# EAGLE design encoder-hbridge (EAGLE 6.4)
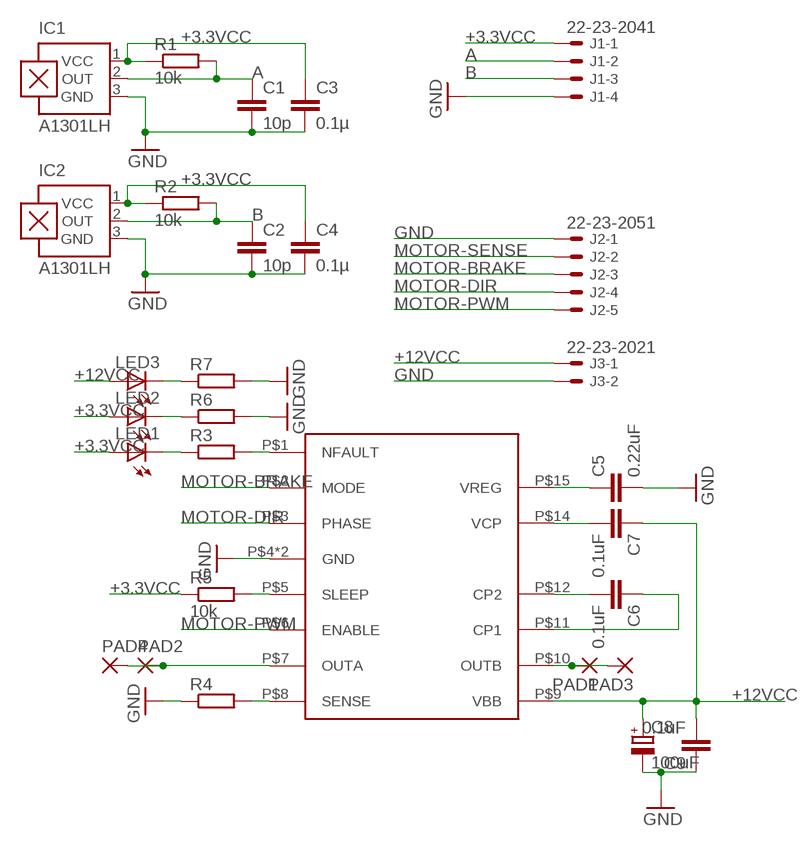
[diagram p0: schematic, sheet 1]

## Parts
C1  10p  C-EUC0805  [C0805]
C2  10p  C-EUC0805  [C0805]
C3  0.1µ  C-EUC0805  [C0805]
C4  0.1µ  C-EUC0805  [C0805]
C5  0.22uF  C-EUC0805  [C0805]
C6  0.1uF  C-EUC0805  [C0805]
C7  0.1uF  C-EUC0805  [C0805]
C8  100uF  CPOL-EUE3.5-8  [E3,5-8]
C9  0.1uF  C-EUC0805  [C0805]
IC1  A1301LH  [SOT23-W]
IC2  A1301LH  [SOT23-W]
J1  22-23-2041  [22-23-2041]
J2  22-23-2051  [22-23-2051]
J3  22-23-2021  [22-23-2021]
LED1  LED3MM  [LED3MM]
LED2  LED3MM  [LED3MM]
LED3  LED3MM  [LED3MM]
PAD1  3,81/1,4  [3,81/1,4]
PAD2  3,81/1,4  [3,81/1,4]
PAD3  3,81/1,4  [3,81/1,4]
PAD4  3,81/1,4  [3,81/1,4]
R1  10k  R-EU_R0805  [R0805]
R2  10k  R-EU_R0805  [R0805]
R3  R-EU_R0805  [R0805]
R4  R-EU_R0805  [R0805]
R5  10k  R-EU_R0805  [R0805]
R6  R-EU_R0805  [R0805]
R7  R-EU_R0805  [R0805]
U$1  A3950-DIL  [DIL16]

## Nets
+3.3VCC: C3.1 C4.1 IC1.1(VCC) IC2.1(VCC) J1.1 LED1.A LED2.A R1.1 R2.1 R5.1
+12VCC: C7.1 C8.+ C9.2 J3.1 LED3.A U$1.P$9(VBB)
A: C1.1 IC1.2(OUT) J1.2 R1.2
B: C2.1 IC2.2(OUT) J1.3 R2.2
GND: C1.2 C2.2 C3.2 C4.2 C5.2 C8.- C9.1 IC1.3(GND) IC2.3(GND) J1.4 J2.1 J3.2 R4.1 R6.2 R7.2 U$1.P$4(GND) U$1.P$13(GND)
MOTOR-BRAKE: J2.3 U$1.P$2(MODE)
MOTOR-DIR: J2.4 U$1.P$3(PHASE)
MOTOR-PWM: J2.5 U$1.P$6(ENABLE)
MOTOR-SENSE: J2.2
N$1: C5.1 U$1.P$15(VREG)
N$6: C6.2 U$1.P$12(CP2)
N$7: C6.1 U$1.P$11(CP1)
N$8: C7.2 U$1.P$14(VCP)
N$9: PAD1.1(P) PAD3.1(P) U$1.P$10(OUTB)
N$10: R3.2 U$1.P$1(NFAULT)
N$11: LED1.K(C) R3.1
N$12: R4.2 U$1.P$8(SENSE)
N$13: R5.2 U$1.P$5(SLEEP)
N$14: LED3.K(C) R7.1
N$15: LED2.K(C) R6.1
N$17: PAD2.1(P) PAD4.1(P) U$1.P$7(OUTA)

## Library data of the parts
C1-C7 C9 = rcl:C-EU: CAPACITOR, European symbol
C8 = resistor:CPOL-EU: POLARIZED CAPACITOR, European symbol
IC1 IC2 = allegro:A13*?: Linear Hall Effect Sensor ICs Continuous-Time Ratiometric High-Temperature Operation Programmable Linear with Analog Output A1302 -Replacement- UGN3503 Source: http://www.allegromicro.com/en/Products/Part_Numbers/1301/1301.pdf http://www.allegromicro.com/en/Products/Part_Numbers/1321/1321.pdf http://www.allegromicro.com/en/Products/Part_Numbers/1381/1381.pdf; MF: ALLEGRO MICROSYSTEMS, INC.; MPN: A1301ELHLT-T; OC_FARNELL: 1198084; OC_NEWARK: 31K6634
J1 = con-molex:22-23-2041: .100" (2.54mm) Center Header - 4 Pin; MF: MOLEX; MPN: 22-23-2041; OC_FARNELL: 1462920; OC_NEWARK: 38C0355
J2 = con-molex:22-23-2051: .100" (2.54mm) Center Header - 5 Pin; MF: MOLEX; MPN: 22-23-2051; OC_FARNELL: 1462952; OC_NEWARK: 38C9178
J3 = con-molex:22-23-2021: .100" (2.54mm) Center Header - 2 Pin; MF: MOLEX; MPN: 22-23-2021; OC_FARNELL: 1462926; OC_NEWARK: 25C3832
LED1-LED3 = adafruit:LED: LED OSRAM: - CHIPLED LG R971, LG N971, LY N971, LG Q971, LY Q971, LO R971, LY R971 LH N974, LH R974 LS Q976, LO Q976, LY Q976 LO Q996 - Hyper CHIPLED LW Q18S LB Q993, LB Q99A, LB R99A - SideLED LS A670, LO A670, LY A670, LG A670, LP A670 LB A673, LV A673, LT A673, LW A673 LH A674 LY A675 LS A676, LA A676, LO A676, LY A676, LW A676 LS A679, LY A679, LG A679 - Hyper Micro SIDELED® LS Y876, LA Y876, LO Y876, LY Y876 LT Y87S - SmartLED LW L88C, LW L88S LB L89C, LB L89S, LG L890 LS L89K, LO L89K, LY L89K LS L896, LA L896, LO L896, LY L896 - TOPLED LS T670, LO T670, LY T670, LG T670, LP T670 LSG T670, LSP T670, LSY T670, LOP T670, LYG T670 LG T671, LOG T671, LSG T671 LB T673, LV T673, LT T673, LW T673 LH T674 LS T676, LA T676, LO T676, LY T676, LB T676, LH T676, LSB T676, LW T676 LB T67C, LV T67C, LT T67C, LS T67K, LO T67K, LY T67K, LW E67C LS E67B, LA E67B, LO E67B, LY E67B, LB E67C, LV E67C, LT E67C LW T67C LS T679, LY T679, LG T679 LS T770, LO T770, LY T770, LG T770, LP T770 LB T773, LV T773, LT T773, LW T773 LH T774 LS E675, LA E675, LY E675, LS T675 LS T776, LA T776, LO T776, LY T776, LB T776 LHGB T686 LT T68C, LB T68C - Hyper Mini TOPLED® LB M676 - Mini TOPLED Santana® LG M470 LS M47K, LO M47K, LY M47K Source: http://www.osram.convergy.de/
PAD1-PAD4 = wirepad:3,81/1,4: THROUGH-HOLE PAD
R1-R7 = rcl:R-EU_: RESISTOR, European symbol
U$1 = A3950:A3950-DIL

## Net classes
0 default: clearance 0.355 mm

## Board
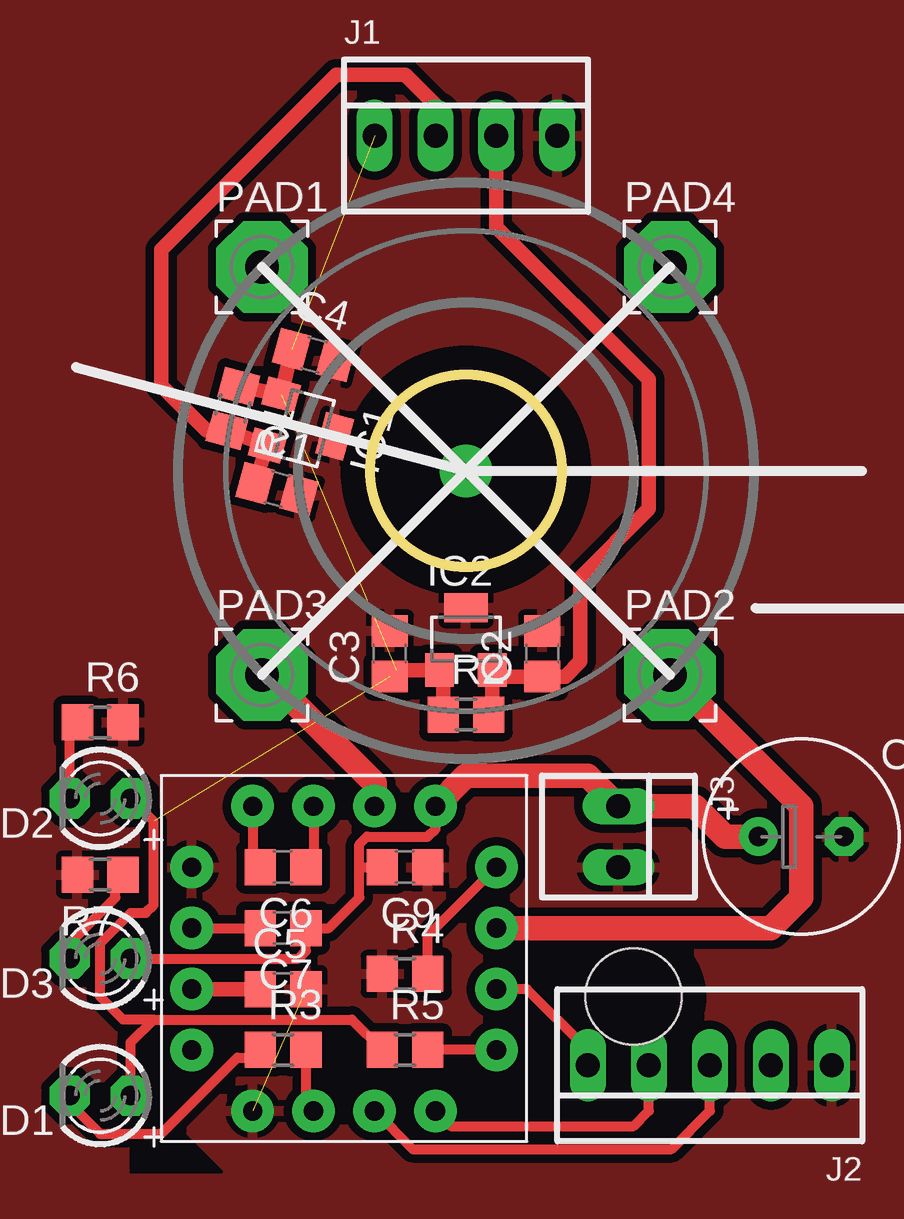
[diagram p1: board, top side]
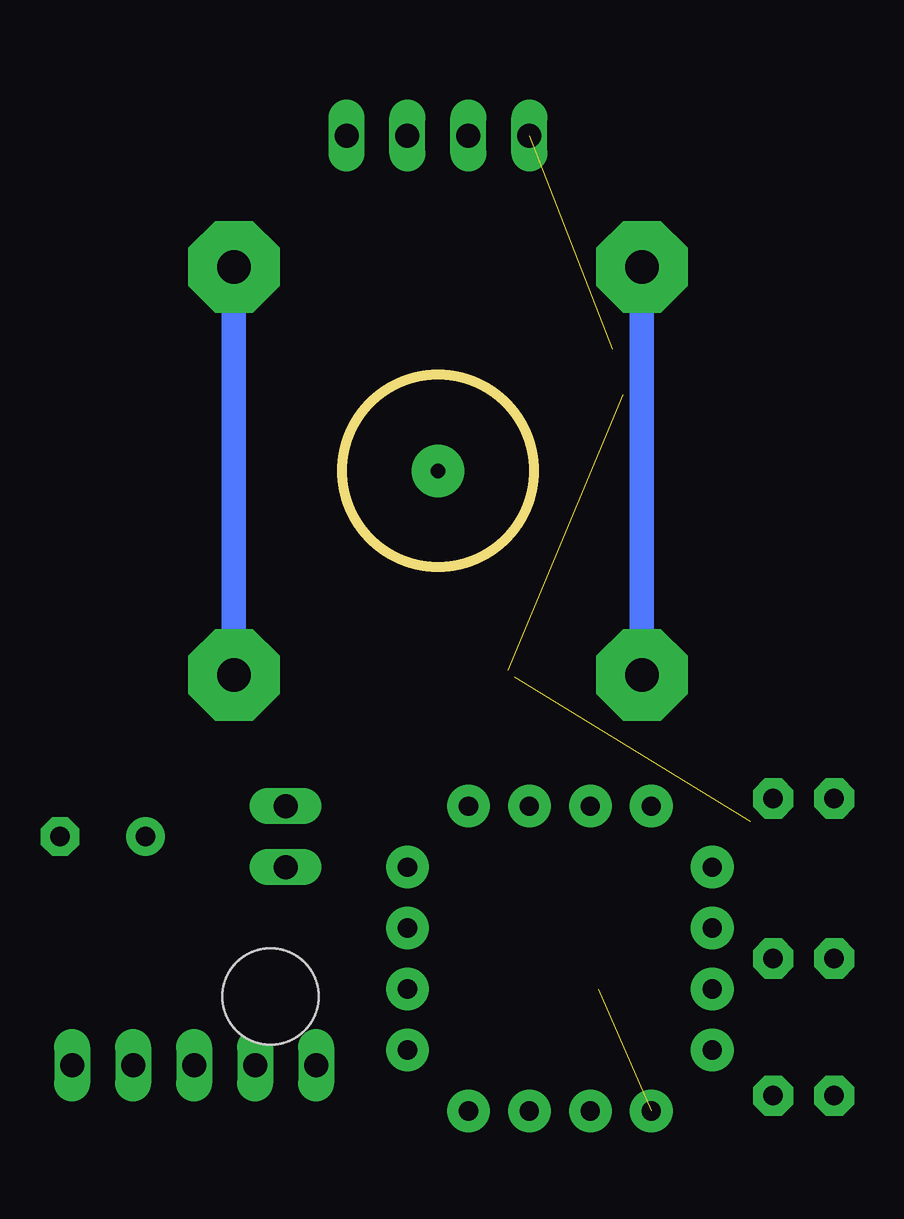
[diagram p2: board, bottom side, seen from below]

Size 8 x 8 mm. Coordinates in mm from the lower left corner, seen from the top.
Outline: circle at 4,4 radius 4
Copper layers (1*16): Top 0.035mm / dielectric 1.5mm / Bottom 0.035mm
Design rules "default": minimum track width 10mil, minimum drill 24mil, track to track 8mil, track to pad 8mil, pad to pad 8mil, via to via 8mil, smd to smd 8mil, copper to edge 40mil, drill to drill 8mil, minimum pad ring 10mil, minimum via ring 8mil, stop-mask expansion 4mil, vias tented up to drill 0mil, thermal gap 10mil
Holes 4 mm at 10.99,-17.91

### Footprints (pad centres in the part's own frame; a part is rotated, then mirrored left to right if it is on the bottom)
C0805 = smd 1.3 x 1.5: 1 -0.95,0; 2 0.95,0
E3,5-8 = drill 0.813 pad 1.6: + -1.778,0 | drill 0.813 pad 1.6 octagon: - 1.778,0
SOT23-W = smd 1.2 x 1.4: 1 -1.1,-1.3; 2 1.1,-1.3 | smd 1.8 x 1.2: 3 0,1.3
22-23-2041 = drill 1 long: 1 -3.81,0; 2 -1.27,0; 3 1.27,0; 4 3.81,0
22-23-2051 = drill 1 long: 1 -5.08,0; 2 -2.54,0; 3 0,0; 4 2.54,0; 5 5.08,0
22-23-2021 = drill 1 long: 1 -1.27,0; 2 1.27,0
LED3MM = drill 0.813 pad 1.676 octagon: A -1.27,0; K 1.27,0
3,81/1,4 = drill 1.397 pad 3.81 octagon: 1 0,0
R0805 = smd 1.3 x 1.5: 1 -0.95,0; 2 0.95,0
DIL16 = drill 0.8 pad 1.778: P$1 -1.27,-6.35; P$2 1.27,-6.35; P$3 3.81,-6.35; P$4 -3.81,-6.35; P$5 6.35,-3.81; P$6 6.35,-1.27; P$7 6.35,1.27; P$8 6.35,3.81; P$9 3.81,6.35; P$10 1.27,6.35; P$11 -1.27,6.35; P$12 -3.81,6.35; P$13 -6.35,3.81; P$14 -6.35,1.27; P$15 -6.35,-1.27; P$16 -6.35,-3.81

### Placement (x,y rotation side)
C1  -3.87,3.24 345 top
C2  7.18,-3.62 90 top
C3  0.82,-3.62 90 top
C4  -2.35,8.83 345 top
C5  -3.62,-17.59 0 top  (outside the outline)
C6  -3.62,-12.51 180 top  (outside the outline)
C7  -3.62,-15.05 180 top  (outside the outline)
C8  17.97,-11.24 0 top  (outside the outline)
C9  1.46,-12.51 180 top  (outside the outline)
IC1  -2.73,5.78 255 top
IC2  4,-3 0 top
J1  4,17.97 0 top  (outside the outline)
J2  14.16,-20.77 180 top  (outside the outline)
J3  10.35,-11.24 270 top  (outside the outline)
LED1  -11.24,-22.03 180 top  (outside the outline)
LED2  -11.24,-9.65 180 top  (outside the outline)
LED3  -11.24,-16.32 180 top  (outside the outline)
PAD1  -4.5,12.5 0 top  (outside the outline)
PAD2  12.5,-4.5 0 top  (outside the outline)
PAD3  -4.5,-4.5 0 top  (outside the outline)
PAD4  12.5,12.5 0 top  (outside the outline)
R1  -5.72,6.6 255 top  (outside the outline)
R2  4,-6.16 0 top  (outside the outline)
R3  -3.62,-20.13 0 top  (outside the outline)
R4  1.46,-16.95 0 top  (outside the outline)
R5  1.46,-20.13 0 top  (outside the outline)
R6  -11.24,-6.48 0 top  (outside the outline)
R7  -11.24,-12.83 180 top  (outside the outline)
U$1  -1.08,-16.32 0 top  (outside the outline)

### Tracks (layer width: path | path; a pad name or v marks a point on that pad's centre or on a via)
+3.3VCC  (3 unrouted)
  Top 0.406: -9.02,-18.86 -9.97,-19.81 LED1.A | R5.1 -0.76,-18.86 -9.02,-18.86 | -9.02,-18.86 -10.29,-18.86 -11.24,-17.91 -11.24,-15.69 -9.97,-14.42 -9.33,-14.42 -9.02,-14.1 -9.02,-10.6 LED2.A
  Top 0.61: R2.1 3.05,-4.45 IC2.1 1.09,-4.3 C3.1 | C4.1 IC1.1 R1.1
+12VCC
  Top 0.406: LED3.A -2.98,-16.32 -2.67,-16 C7.1 | C7.1 | C7.1 -1.72,-15.05 -0.44,-13.78 -0.44,-12.51 | -0.44,-12.51 C9.2 | -0.44,-12.51 -0.44,-11.56 -0.13,-11.24 2.41,-11.24 2.73,-10.92 U$1.P$9
  Top 1.016: U$1.P$9 4,-8.7 9.08,-8.7 J3.1 13.53,-9.97 14.79,-11.24 C8.+
A
  Top 0.61: J1.2 2.73,19.24 1.46,20.51 -1.4,20.51 -8.7,13.21 -8.7,7.56 -6.83,5.69 R1.2 IC1.2 C1.1
B
  Top 0.61: R2.2 5.1,-6.01 IC2.2 5.37,-4.57 C2.1 8.13,-4.57 8.76,-3.94 8.76,-0.45 11.62,2.41 11.62,7.81 5.27,14.16 J1.3
GND  (1 unrouted)
  pour Top: -19.81,27.81 -19.81,-29.66 25.59,-29.66 25.59,27.81
MOTOR-BRAKE
  Top 0.406: U$1.P$2 1.78,-24.26 12.57,-24.26 14.16,-22.67 J2.3
MOTOR-DIR
  Top 0.406: U$1.P$3 3.37,-23.3 10.99,-23.3 11.62,-22.67 J2.4
MOTOR-PWM
  Top 0.406: J2.5 9.08,-20.13 6.54,-17.59 U$1.P$6
N$1
  Top 0.61: C5.1 U$1.P$15
N$5  (via drill 0.6 pad 2.18)
  other vias: 4,4
N$6
  Top 0.406: U$1.P$12 -4.89,-12.19 C6.2
N$7
  Top 0.406: U$1.P$11 -2.35,-12.19 C6.1
N$8
  Top 0.406: U$1.P$14 C7.2
N$9
  Top 1.016: PAD3.1 -4.33,-4.5 0.19,-9.02 U$1.P$10
  Bottom 1.016: PAD1.1 PAD3.1
N$10
  Top 0.406: R3.2 -2.67,-22.35 U$1.P$1
N$11
  Top 0.406: LED1.K -12.51,-22.35 -11.24,-23.62 -8.7,-23.62 -5.53,-20.45 -4.89,-20.45 R3.1
N$12
  Top 0.406: R4.2 2.41,-15.37 U$1.P$8
N$13
  Top 0.406: U$1.P$5 R5.2
N$14
  Top 0.406: LED3.K -12.51,-15.69 -10.61,-13.78 -10.61,-12.83 R7.1
N$15
  Top 0.406: LED2.K -12.51,-6.48 R6.1
N$17
  Top 1.016: U$1.P$7 16.7,-15.05 17.97,-13.78 17.97,-9.97 PAD2.1
  Bottom 1.016: PAD4.1 PAD2.1

### Text on the board
Top: GobGob 2013
_tNames: C4 | IC1 | R1 | C1 | IC2 | C3 | R2 | C2 | JP1